# EAGLE schematic ASuitable Number Of Microphones (EAGLE 7.7.0)
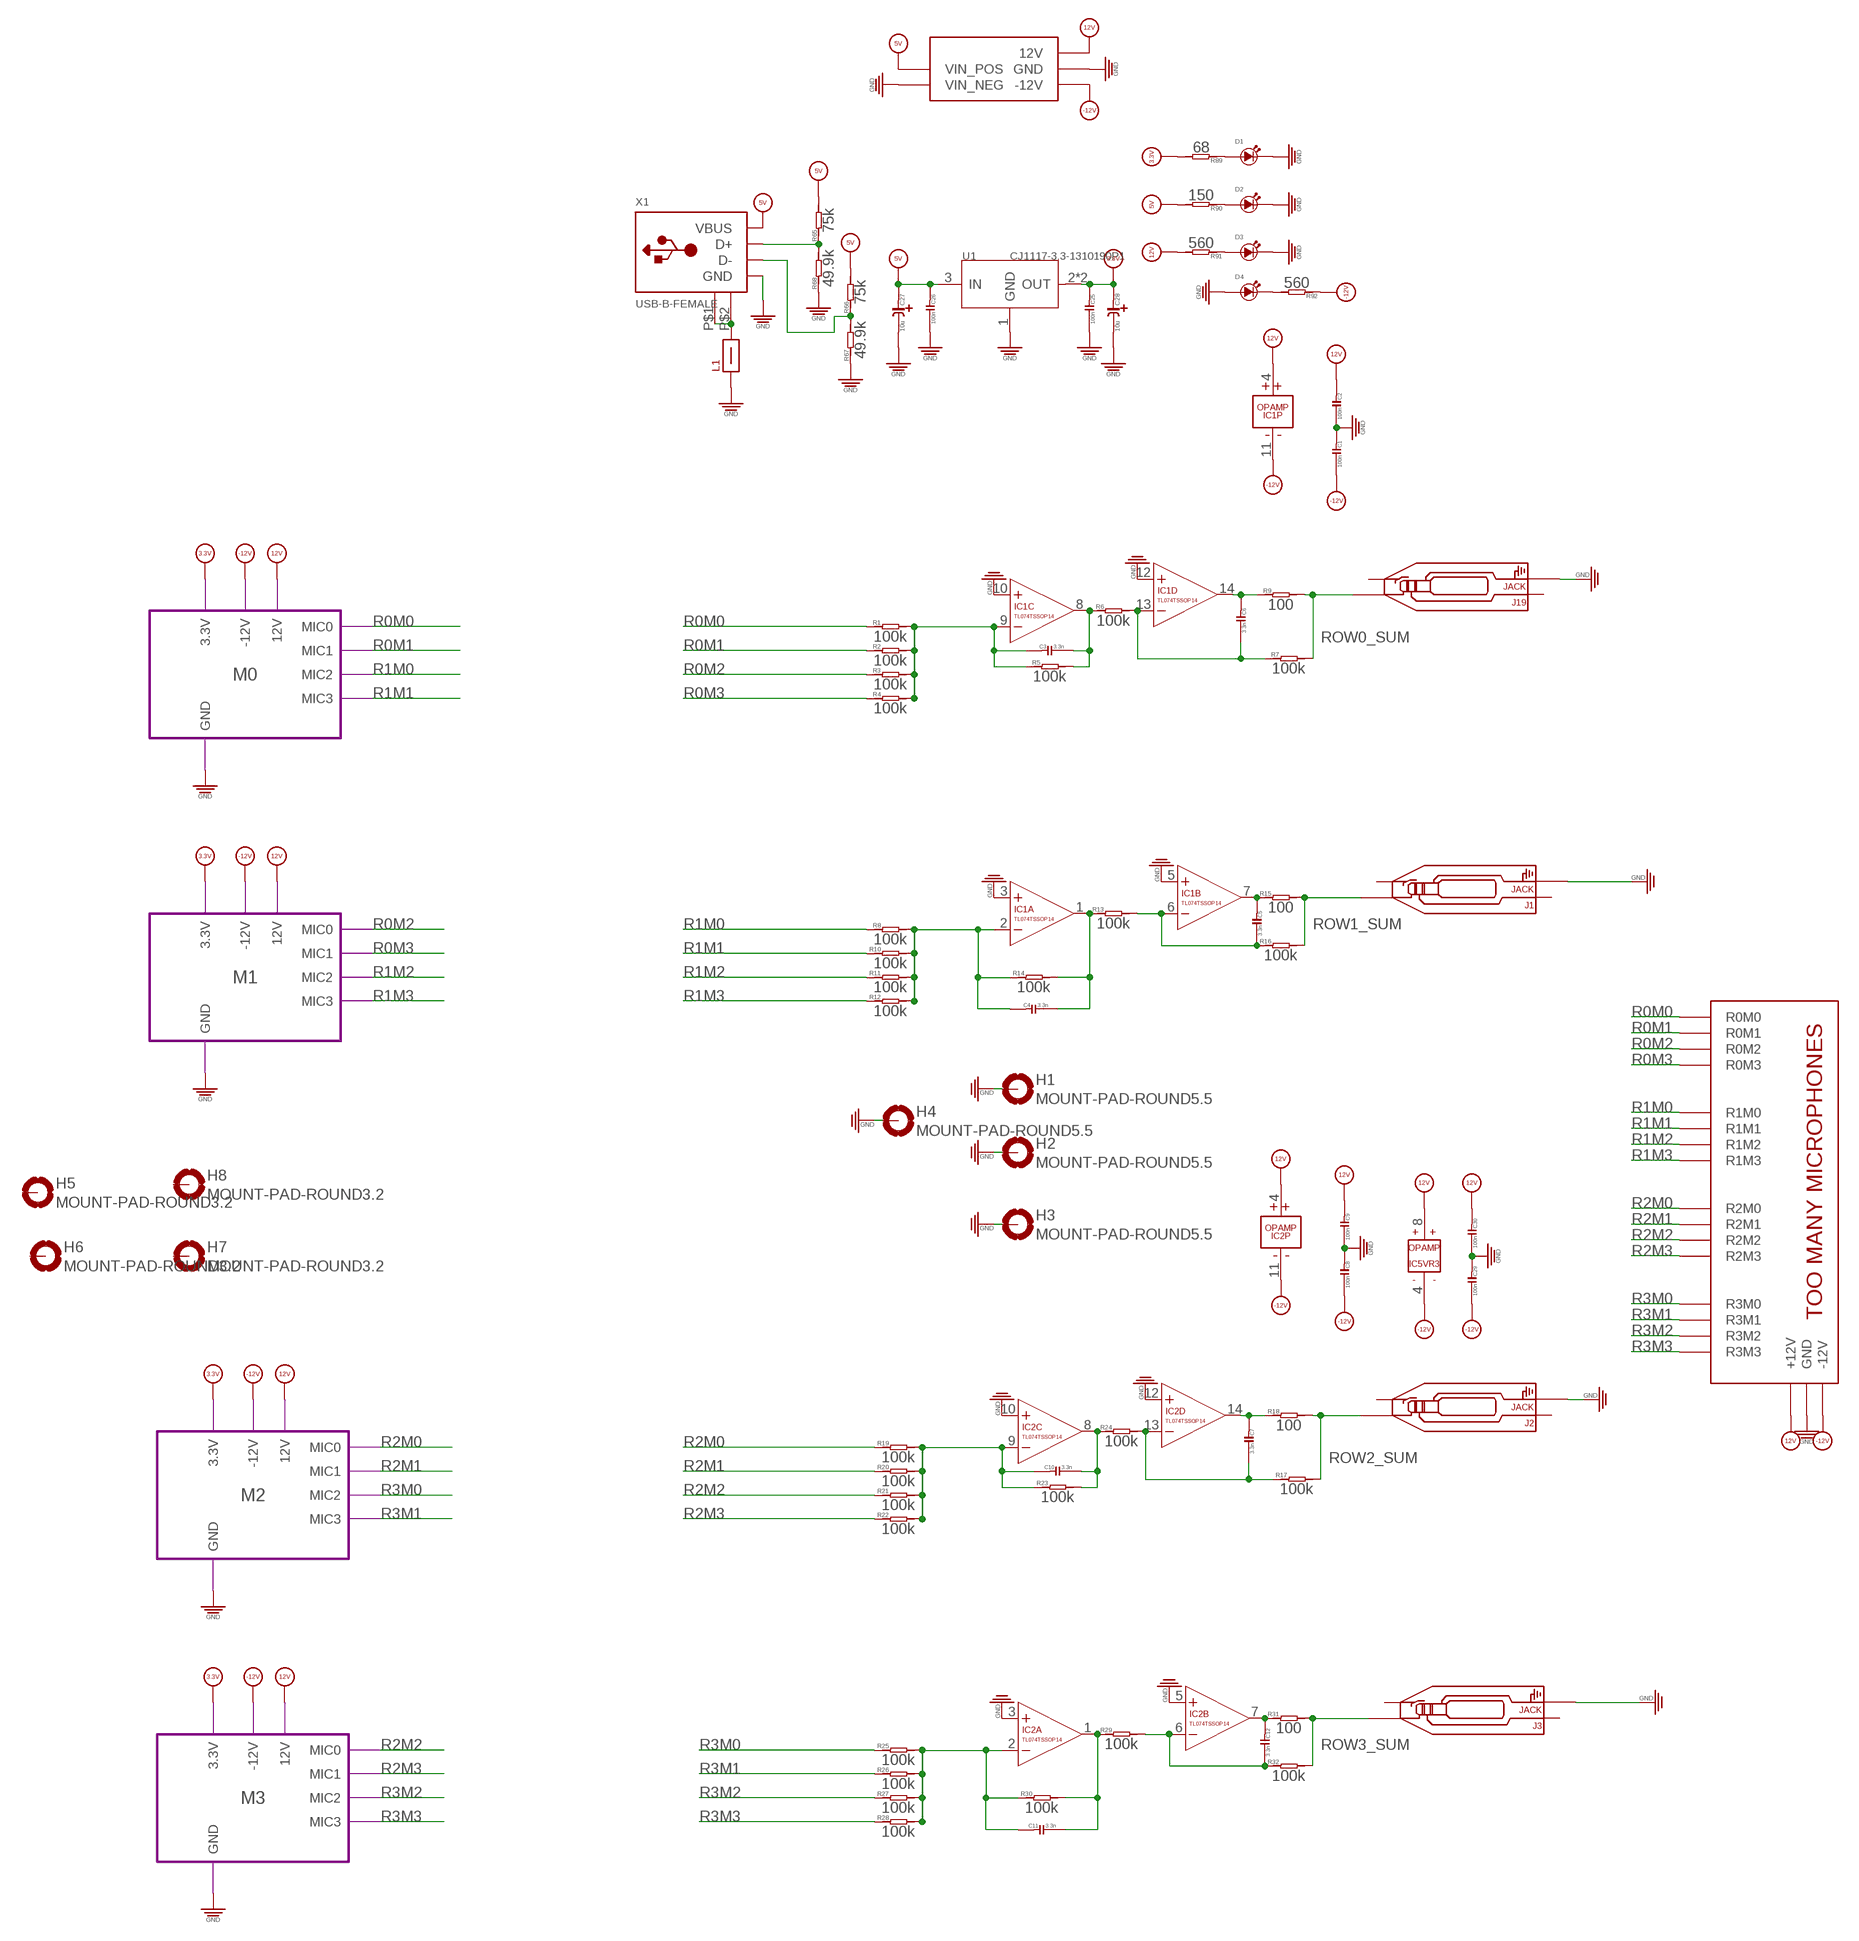
[diagram p0: schematic, sheet 1, part 1 of 2]
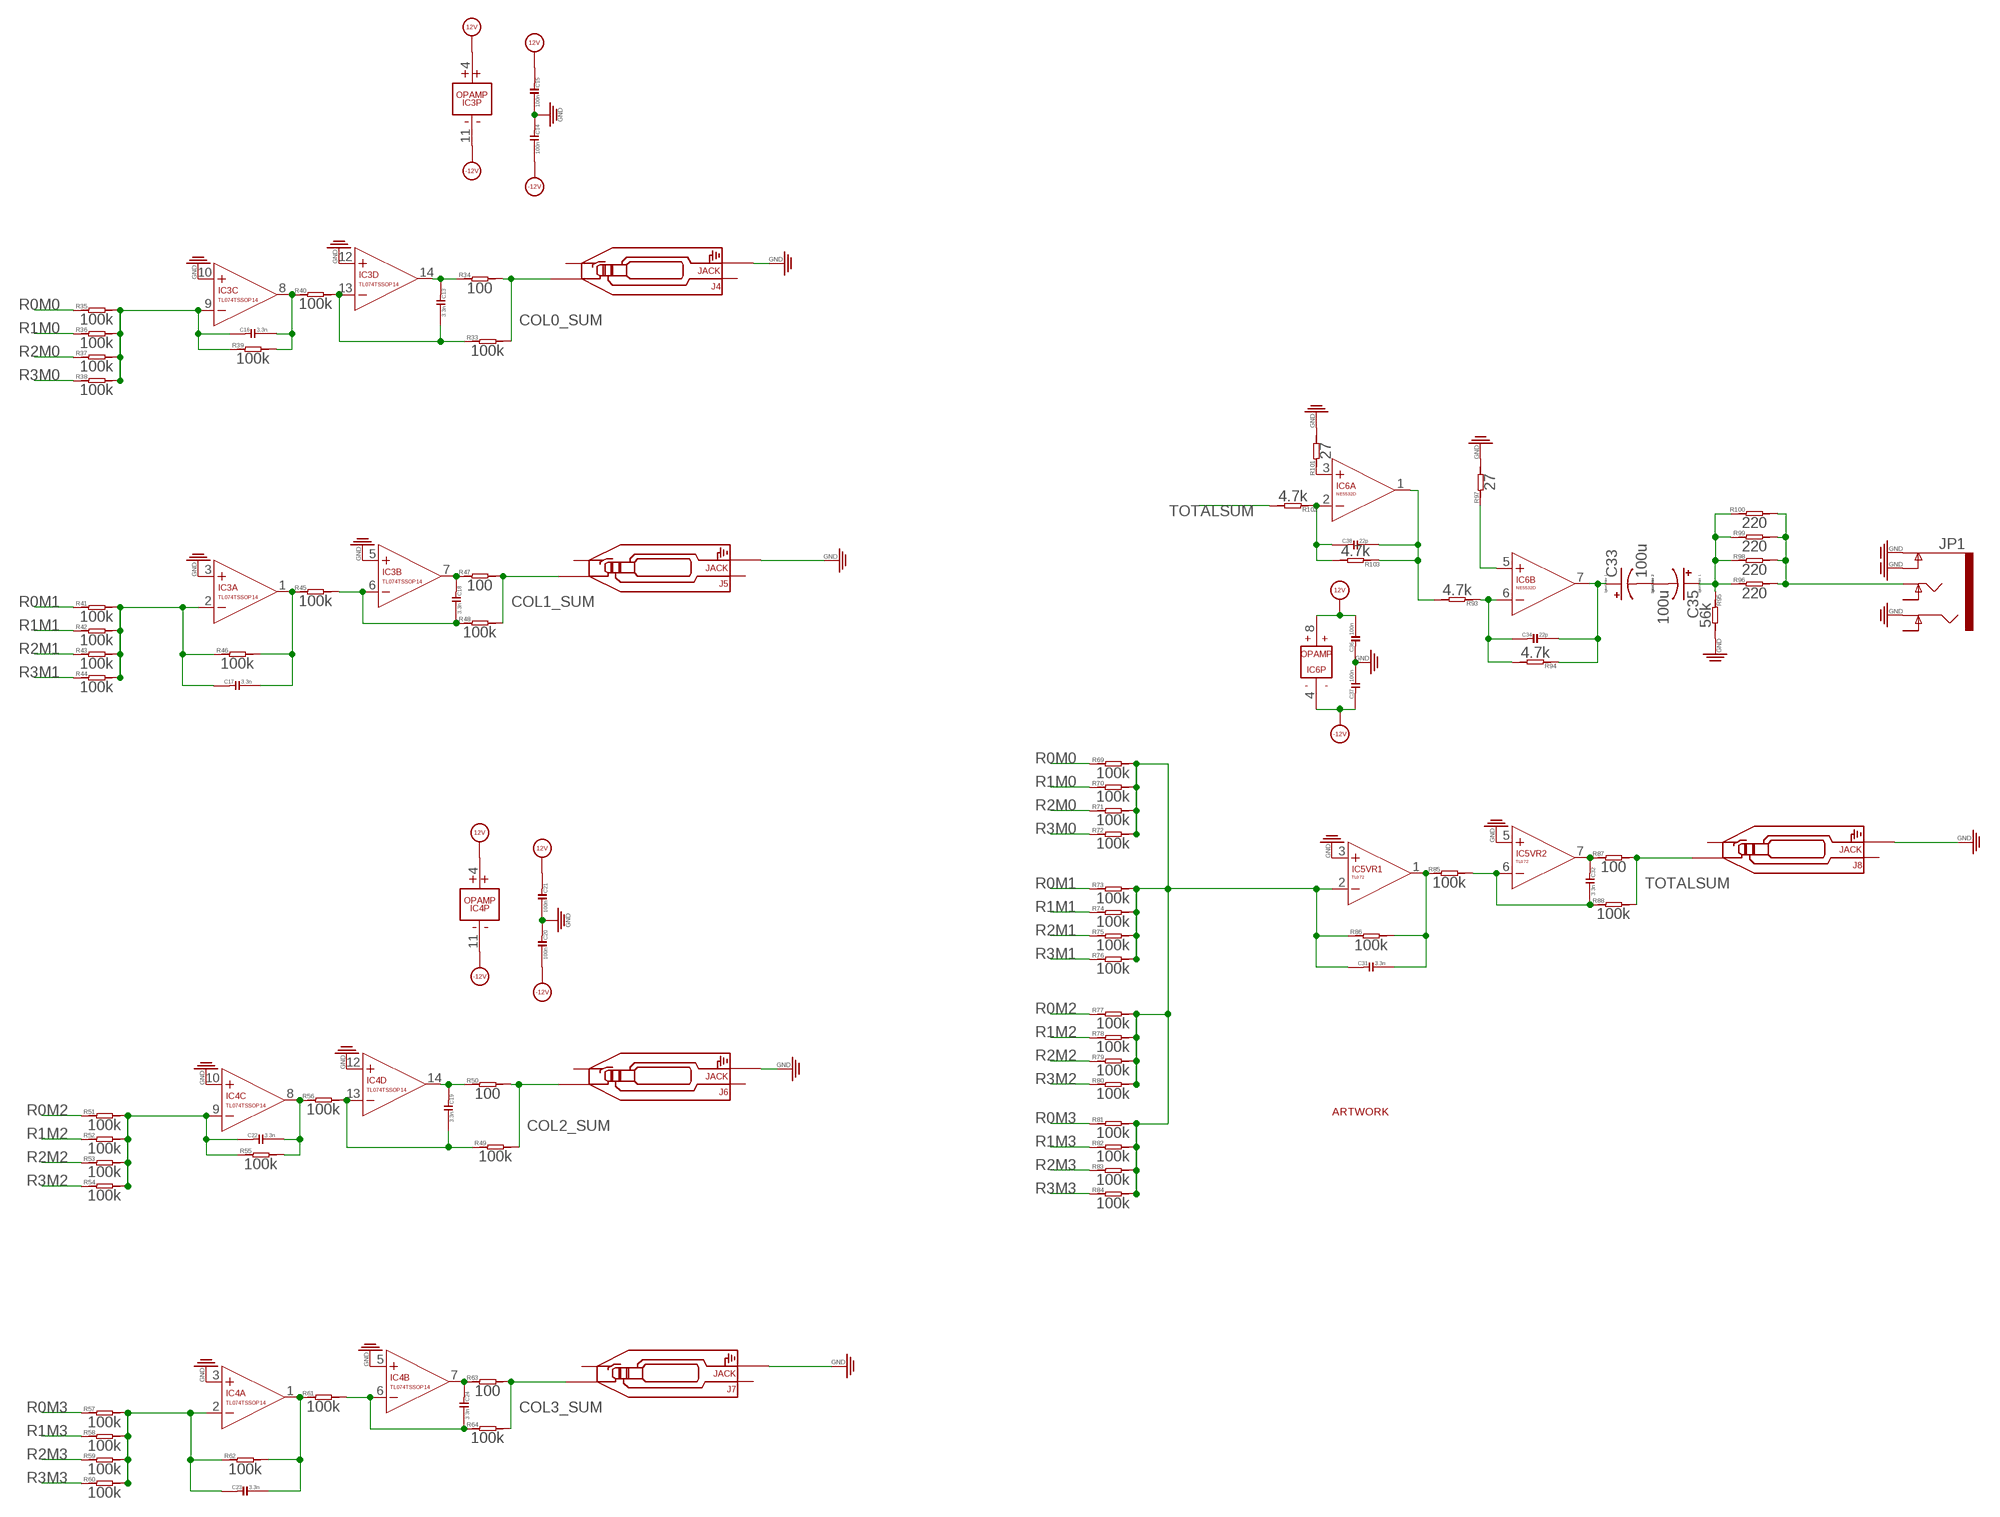
[diagram p1: schematic, sheet 1, part 2 of 2]

## Parts
C1  100n  C-0603  [C0603]
C2  100n  C-0603  [C0603]
C3  3.3n  C-0603  [C0603]
C4  3.3n  C-0603  [C0603]
C5  3.3n  C-0603  [C0603]
C6  3.3n  C-0603  [C0603]
C7  3.3n  C-0603  [C0603]
C8  100n  C-0603  [C0603]
C9  100n  C-0603  [C0603]
C10  3.3n  C-0603  [C0603]
C11  3.3n  C-0603  [C0603]
C12  3.3n  C-0603  [C0603]
C13  3.3n  C-0603  [C0603]
C14  100n  C-0603  [C0603]
C15  100n  C-0603  [C0603]
C16  3.3n  C-0603  [C0603]
C17  3.3n  C-0603  [C0603]
C18  3.3n  C-0603  [C0603]
C19  3.3n  C-0603  [C0603]
C20  100n  C-0603  [C0603]
C21  100n  C-0603  [C0603]
C22  3.3n  C-0603  [C0603]
C23  3.3n  C-0603  [C0603]
C24  3.3n  C-0603  [C0603]
C25  100n  C-0603  [C0603]
C26  100n  C-0603  [C0603]
C27  10u  C-POLAR-A  [CASE-A_3216]
C28  10u  C-POLAR-A  [CASE-A_3216]
C29  100n  C-0603  [C0603]
C30  100n  C-0603  [C0603]
C31  3.3n  C-0603  [C0603]
C32  3.3n  C-0603  [C0603]
C33  100u  CPOL-USD  [PANASONIC_D]
C34  22p  C-0603  [C0603]
C35  100u  CPOL-USD  [PANASONIC_D]
C36  100n  C-0603  [C0603]
C37  100n  C-0603  [C0603]
C38  22p  C-0603  [C0603]
D1  LED  [LED0603]
D2  LED  [LED0603]
D3  LED  [LED0603]
D4  LED  [LED0603]
H1  MOUNT-PAD-ROUND5.5  [5,5-PAD]
H2  MOUNT-PAD-ROUND5.5  [5,5-PAD]
H3  MOUNT-PAD-ROUND5.5  [5,5-PAD]
H4  MOUNT-PAD-ROUND5.5  [5,5-PAD]
H5  MOUNT-PAD-ROUND3.2  [3,2-PAD]
H6  MOUNT-PAD-ROUND3.2  [3,2-PAD]
H7  MOUNT-PAD-ROUND3.2  [3,2-PAD]
H8  MOUNT-PAD-ROUND3.2  [3,2-PAD]
IC1  TL074TSSOP14  [TSSOP14]
IC2  TL074TSSOP14  [TSSOP14]
IC3  TL074TSSOP14  [TSSOP14]
IC4  TL074TSSOP14  [TSSOP14]
IC5  TL072  [SO08]
IC6  NE5532D  [SO08]
J1  JACK  AUDIO-JACK_SMALLSYMBOLNODRILL  [3.5MM-JACK-SWITCH-13MM-NOHOLES]
J2  JACK  AUDIO-JACK_SMALLSYMBOLNODRILL  [3.5MM-JACK-SWITCH-13MM-NOHOLES]
J3  JACK  AUDIO-JACK_SMALLSYMBOLNODRILL  [3.5MM-JACK-SWITCH-13MM-NOHOLES]
J4  JACK  AUDIO-JACK_SMALLSYMBOLNODRILL  [3.5MM-JACK-SWITCH-13MM-NOHOLES]
J5  JACK  AUDIO-JACK_SMALLSYMBOLNODRILL  [3.5MM-JACK-SWITCH-13MM-NOHOLES]
J6  JACK  AUDIO-JACK_SMALLSYMBOLNODRILL  [3.5MM-JACK-SWITCH-13MM-NOHOLES]
J7  JACK  AUDIO-JACK_SMALLSYMBOLNODRILL  [3.5MM-JACK-SWITCH-13MM-NOHOLES]
J8  JACK  AUDIO-JACK_SMALLSYMBOLNODRILL  [3.5MM-JACK-SWITCH-13MM-NOHOLES]
J19  JACK  AUDIO-JACK_SMALLSYMBOLNODRILL  [3.5MM-JACK-SWITCH-13MM-NOHOLES]
JP1  AUDIO-JACK4-.25-HORIZ-TRS  [AUDIO-JACK-.25-INCH-HORIZ-PTH]
L1  FERRITE_1812  [FERRITE_1812]
R1  100k  R-0603  [R0603]
R2  100k  R-0603  [R0603]
R3  100k  R-0603  [R0603]
R4  100k  R-0603  [R0603]
R5  100k  R-0603  [R0603]
R6  100k  R-0603  [R0603]
R7  100k  R-0603  [R0603]
R8  100k  R-0603  [R0603]
R9  100  R-0603  [R0603]
R10  100k  R-0603  [R0603]
R11  100k  R-0603  [R0603]
R12  100k  R-0603  [R0603]
R13  100k  R-0603  [R0603]
R14  100k  R-0603  [R0603]
R15  100  R-0603  [R0603]
R16  100k  R-0603  [R0603]
R17  100k  R-0603  [R0603]
R18  100  R-0603  [R0603]
R19  100k  R-0603  [R0603]
R20  100k  R-0603  [R0603]
R21  100k  R-0603  [R0603]
R22  100k  R-0603  [R0603]
R23  100k  R-0603  [R0603]
R24  100k  R-0603  [R0603]
R25  100k  R-0603  [R0603]
R26  100k  R-0603  [R0603]
R27  100k  R-0603  [R0603]
R28  100k  R-0603  [R0603]
R29  100k  R-0603  [R0603]
R30  100k  R-0603  [R0603]
R31  100  R-0603  [R0603]
R32  100k  R-0603  [R0603]
R33  100k  R-0603  [R0603]
R34  100  R-0603  [R0603]
R35  100k  R-0603  [R0603]
R36  100k  R-0603  [R0603]
R37  100k  R-0603  [R0603]
R38  100k  R-0603  [R0603]
R39  100k  R-0603  [R0603]
R40  100k  R-0603  [R0603]
R41  100k  R-0603  [R0603]
R42  100k  R-0603  [R0603]
R43  100k  R-0603  [R0603]
R44  100k  R-0603  [R0603]
R45  100k  R-0603  [R0603]
R46  100k  R-0603  [R0603]
R47  100  R-0603  [R0603]
R48  100k  R-0603  [R0603]
R49  100k  R-0603  [R0603]
R50  100  R-0603  [R0603]
R51  100k  R-0603  [R0603]
R52  100k  R-0603  [R0603]
R53  100k  R-0603  [R0603]
R54  100k  R-0603  [R0603]
R55  100k  R-0603  [R0603]
R56  100k  R-0603  [R0603]
R57  100k  R-0603  [R0603]
R58  100k  R-0603  [R0603]
R59  100k  R-0603  [R0603]
R60  100k  R-0603  [R0603]
R61  100k  R-0603  [R0603]
R62  100k  R-0603  [R0603]
R63  100  R-0603  [R0603]
R64  100k  R-0603  [R0603]
R65  75k  R-0603  [R0603]
R66  75k  R-0603  [R0603]
R67  49.9k  R-0603  [R0603]
R68  49.9k  R-0603  [R0603]
R69  100k  R-0603  [R0603]
R70  100k  R-0603  [R0603]
R71  100k  R-0603  [R0603]
R72  100k  R-0603  [R0603]
R73  100k  R-0603  [R0603]
R74  100k  R-0603  [R0603]
R75  100k  R-0603  [R0603]
R76  100k  R-0603  [R0603]
R77  100k  R-0603  [R0603]
R78  100k  R-0603  [R0603]
R79  100k  R-0603  [R0603]
R80  100k  R-0603  [R0603]
R81  100k  R-0603  [R0603]
R82  100k  R-0603  [R0603]
R83  100k  R-0603  [R0603]
R84  100k  R-0603  [R0603]
R85  100k  R-0603  [R0603]
R86  100k  R-0603  [R0603]
R87  100  R-0603  [R0603]
R88  100k  R-0603  [R0603]
R89  68  R-0603  [R0603]
R90  150  R-0603  [R0603]
R91  560  R-0603  [R0603]
R92  560  R-0603  [R0603]
R93  4.7k  R-0603  [R0603]
R94  4.7k  R-0603  [R0603]
R95  56k  R-0603  [R0603]
R96  220  R-0603  [R0603]
R97  27  R-0603  [R0603]
R98  220  R-0603  [R0603]
R99  220  R-0603  [R0603]
R100  220  R-0603  [R0603]
R101  27  R-0603  [R0603]
R102  4.7k  R-0603  [R0603]
R103  4.7k  R-0603  [R0603]
U1  CJ1117-3.3-1310190P1  [SOT223]
U$29  TOOMANYMICROPHONES  [TOOMANYMICROPHONES]
U$42  CINCONBRICK_12V  [CINCONBRICK]
U$51  TINRS_ARTWORKTINYDATE  [JUSTATINYROCKET_DATECODE]
X1  USB-B-FEMALE  [FCI61729]

## Module instances
M0 = 4XMIC
M1 = 4XMIC
M2 = 4XMIC
M3 = 4XMIC

## Nets
3.3V [pwr]: C25.1 C28.+ R89.2 U1.2(OUT) U1.TER(OUT) ; port M0.3.3V M1.3.3V M2.3.3V M3.3.3V
5V [pwr]: C26.1 C27.+ R65.2 R66.2 R90.2 U1.3(IN) U$42.1(VIN_POS) U$42.24(VIN_POS) X1.1(VBUS)
12V [pwr]: C2.1 C9.1 C15.1 C21.1 C30.1 C36.2 IC1.4(P:V+) IC2.4(P:V+) IC3.4(P:V+) IC4.4(P:V+) IC5.8(VR3:V+) IC6.8(P:V+) R91.2 U$29.+12@1(+12V) U$29.+12@2(+12V) U$42.11(12V) U$42.14(12V) ; port M0.12V M1.12V M2.12V M3.12V
-12V [pwr]: C1.2 C8.2 C14.2 C20.2 C29.2 C37.1 IC1.11(P:V-) IC2.11(P:V-) IC3.11(P:V-) IC4.11(P:V-) IC5.4(VR3:V-) IC6.4(P:V-) R92.1 U$29.-12@1(-12V) U$29.-12@2(-12V) U$42.2(-12V) U$42.23(-12V) ; port M0.-12V M1.-12V M2.-12V M3.-12V
COL0_SUM: J4.TIP_B@1(TIP) J4.TIP_T@3(TIP) R33.2 R34.2
COL1_SUM: J5.TIP_B@1(TIP) J5.TIP_T@3(TIP) R47.2 R48.2
COL2_SUM: J6.TIP_B@1(TIP) J6.TIP_T@3(TIP) R49.2 R50.2
COL3_SUM: J7.TIP_B@1(TIP) J7.TIP_T@3(TIP) R63.2 R64.2
GND: C1.1 C2.2 C8.1 C9.2 C14.1 C15.2 C20.1 C21.2 C25.2 C26.2 C27.- C28.- C29.1 C30.2 C36.1 C37.2 D1.- D2.- D3.- D4.+ H1.B5,5(MOUNT) H2.B5,5(MOUNT) H3.B5,5(MOUNT) H4.B5,5(MOUNT) IC1.3(A:+IN) IC1.5(B:+IN) IC1.10(C:+IN) IC1.12(D:+IN) IC2.3(A:+IN) IC2.5(B:+IN) IC2.10(C:+IN) IC2.12(D:+IN) IC3.3(A:+IN) IC3.5(B:+IN) IC3.10(C:+IN) IC3.12(D:+IN) IC4.3(A:+IN) IC4.5(B:+IN) IC4.10(C:+IN) IC4.12(D:+IN) IC5.3(VR1:+IN) IC5.5(VR2:+IN) J1.RING_B@1(RING) J1.RING_T@3(RING) J2.RING_B@1(RING) J2.RING_T@3(RING) J3.RING_B@1(RING) J3.RING_T@3(RING) J4.RING_B@1(RING) J4.RING_T@3(RING) J5.RING_B@1(RING) J5.RING_T@3(RING) J6.RING_B@1(RING) J6.RING_T@3(RING) J7.RING_B@1(RING) J7.RING_T@3(RING) J8.RING_B@1(RING) J8.RING_T@3(RING) J19.RING_B@1(RING) J19.RING_T@3(RING) JP1.P$2(EARTH) JP1.P$3(EARTH-NORM) JP1.P$4(RING) L1.P$1 R67.1 R68.1 R95.2 R97.2 R101.2 U1.1(GND) U$29.GND@1(GND) U$29.GND@2(GND) U$29.GND@3(GND) U$29.GND@4(GND) U$42.3(GND) U$42.10(GND) U$42.12(VIN_NEG) U$42.13(VIN_NEG) U$42.15(GND) U$42.22(GND) X1.4(GND) ; port M0.GND M1.GND M2.GND M3.GND
N$1: C3.1 IC1.9(C:-IN) R1.2 R2.2 R3.2 R4.2 R5.1
N$2: C6.1 IC1.14(D:OUT) R9.1
N$3: C6.2 IC1.13(D:-IN) R6.2 R7.1
N$4: L1.P$2 X1.P$1(GND1) X1.P$2(GND2)
N$5: R66.1 R67.2 X1.2(D-)
N$6: R65.1 R68.2 X1.3(D+)
N$7: C31.1 IC5.2(VR1:-IN) R69.2 R70.2 R71.2 R72.2 R73.2 R74.2 R75.2 R76.2 R77.2 R78.2 R79.2 R80.2 R81.2 R82.2 R83.2 R84.2 R86.1
N$8: C3.2 IC1.8(C:OUT) R5.2 R6.1
N$9: C4.1 IC1.2(A:-IN) R8.2 R10.2 R11.2 R12.2 R14.1
N$10: C33.- C35.-
N$11: D1.+ R89.1
N$12: D2.+ R90.1
N$13: D3.+ R91.1
N$14: C4.2 IC1.1(A:OUT) R13.1 R14.2
N$15: C5.1 IC1.7(B:OUT) R15.1
N$16: C5.2 IC1.6(B:-IN) R13.2 R16.1
N$17: C10.1 IC2.9(C:-IN) R19.2 R20.2 R21.2 R22.2 R23.1
N$18: C7.1 IC2.14(D:OUT) R18.1
N$19: D4.- R92.2
N$20: C31.2 IC5.1(VR1:OUT) R85.1 R86.2
N$21: C32.1 IC5.7(VR2:OUT) R87.1
N$22: C32.2 IC5.6(VR2:-IN) R85.2 R88.1
N$23: C7.2 IC2.13(D:-IN) R17.1 R24.2
N$24: C10.2 IC2.8(C:OUT) R23.2 R24.1
N$25: C11.1 IC2.2(A:-IN) R25.2 R26.2 R27.2 R28.2 R30.1
N$26: C34.1 IC6.6(B:-IN) R93.1 R94.2
N$27: C33.+ C34.2 IC6.7(B:OUT) R94.1
N$28: C35.+ R95.1 R96.1 R98.1 R99.1 R100.1
N$29: IC6.5(B:+IN) R97.1
N$30: C11.2 IC2.1(A:OUT) R29.1 R30.2
N$31: C12.1 IC2.7(B:OUT) R31.1
N$32: C12.2 IC2.6(B:-IN) R29.2 R32.1
N$33: C16.1 IC3.9(C:-IN) R35.2 R36.2 R37.2 R38.2 R39.1
N$34: C13.1 IC3.14(D:OUT) R34.1
N$35: IC6.3(A:+IN) R101.1
N$36: C38.1 IC6.2(A:-IN) R102.1 R103.2
N$37: C38.2 IC6.1(A:OUT) R93.2 R103.1
N$39: C13.2 IC3.13(D:-IN) R33.1 R40.2
N$40: C16.2 IC3.8(C:OUT) R39.2 R40.1
N$41: C17.1 IC3.2(A:-IN) R41.2 R42.2 R43.2 R44.2 R46.1
N$46: C17.2 IC3.1(A:OUT) R45.1 R46.2
N$47: C18.1 IC3.7(B:OUT) R47.1
N$48: C18.2 IC3.6(B:-IN) R45.2 R48.1
N$49: C22.1 IC4.9(C:-IN) R51.2 R52.2 R53.2 R54.2 R55.1
N$50: C19.1 IC4.14(D:OUT) R50.1
N$55: C19.2 IC4.13(D:-IN) R49.1 R56.2
N$56: C22.2 IC4.8(C:OUT) R55.2 R56.1
N$57: C23.1 IC4.2(A:-IN) R57.2 R58.2 R59.2 R60.2 R62.1
N$62: C23.2 IC4.1(A:OUT) R61.1 R62.2
N$63: C24.1 IC4.7(B:OUT) R63.1
N$64: C24.2 IC4.6(B:-IN) R61.2 R64.1
OUTTIPLEFT: JP1.P$6(TIP) R96.2 R98.2 R99.2 R100.2
R0M0: R1.1 R35.1 R69.1 U$29.P$1(R0M0) ; port M0.MIC0
R0M1: R2.1 R41.1 R73.1 U$29.P$2(R0M1) ; port M0.MIC1
R0M2: R3.1 R51.1 R77.1 U$29.P$3(R0M2) ; port M1.MIC0
R0M3: R4.1 R57.1 R81.1 U$29.P$4(R0M3) ; port M1.MIC1
R1M0: R8.1 R36.1 R70.1 U$29.P$5(R1M0) ; port M0.MIC2
R1M1: R10.1 R42.1 R74.1 U$29.P$6(R1M1) ; port M0.MIC3
R1M2: R11.1 R52.1 R78.1 U$29.P$7(R1M2) ; port M1.MIC2
R1M3: R12.1 R58.1 R82.1 U$29.P$8(R1M3) ; port M1.MIC3
R2M0: R19.1 R37.1 R71.1 U$29.P$9(R2M0) ; port M2.MIC0
R2M1: R20.1 R43.1 R75.1 U$29.P$10(R2M1) ; port M2.MIC1
R2M2: R21.1 R53.1 R79.1 U$29.P$11(R2M2) ; port M3.MIC0
R2M3: R22.1 R59.1 R83.1 U$29.P$12(R2M3) ; port M3.MIC1
R3M0: R25.1 R38.1 R72.1 U$29.P$13(R3M0) ; port M2.MIC2
R3M1: R26.1 R44.1 R76.1 U$29.P$14(R3M1) ; port M2.MIC3
R3M2: R27.1 R54.1 R80.1 U$29.P$15(R3M2) ; port M3.MIC2
R3M3: R28.1 R60.1 R84.1 U$29.P$16(R3M3) ; port M3.MIC3
ROW0_SUM: J19.TIP_B@1(TIP) J19.TIP_T@3(TIP) R7.2 R9.2
ROW1_SUM: J1.TIP_B@1(TIP) J1.TIP_T@3(TIP) R15.2 R16.2
ROW2_SUM: J2.TIP_B@1(TIP) J2.TIP_T@3(TIP) R17.2 R18.2
ROW3_SUM: J3.TIP_B@1(TIP) J3.TIP_T@3(TIP) R31.2 R32.2
TOTALSUM: J8.TIP_B@1(TIP) J8.TIP_T@3(TIP) R87.2 R88.2 R102.2
Unconnected: H5.B3,2(MOUNT) H6.B3,2(MOUNT) H7.B3,2(MOUNT) H8.B3,2(MOUNT) J1.SECOND_B@1(SECOND) J1.SECOND_T@3(SECOND) J1.SWITCH_B@1(SWITCH) J1.SWITCH_T@3(SWITCH) J2.SECOND_B@1(SECOND) J2.SECOND_T@3(SECOND) J2.SWITCH_B@1(SWITCH) J2.SWITCH_T@3(SWITCH) J3.SECOND_B@1(SECOND) J3.SECOND_T@3(SECOND) J3.SWITCH_B@1(SWITCH) J3.SWITCH_T@3(SWITCH) J4.SECOND_B@1(SECOND) J4.SECOND_T@3(SECOND) J4.SWITCH_B@1(SWITCH) J4.SWITCH_T@3(SWITCH) J5.SECOND_B@1(SECOND) J5.SECOND_T@3(SECOND) J5.SWITCH_B@1(SWITCH) J5.SWITCH_T@3(SWITCH) J6.SECOND_B@1(SECOND) J6.SECOND_T@3(SECOND) J6.SWITCH_B@1(SWITCH) J6.SWITCH_T@3(SWITCH) J7.SECOND_B@1(SECOND) J7.SECOND_T@3(SECOND) J7.SWITCH_B@1(SWITCH) J7.SWITCH_T@3(SWITCH) J8.SECOND_B@1(SECOND) J8.SECOND_T@3(SECOND) J8.SWITCH_B@1(SWITCH) J8.SWITCH_T@3(SWITCH) J19.SECOND_B@1(SECOND) J19.SECOND_T@3(SECOND) J19.SWITCH_B@1(SWITCH) J19.SWITCH_T@3(SWITCH) JP1.P$5(RING-NORM) JP1.P$7(TIP-NORM)

## Library data of the parts
C1-C26 C29-C32 C34 C36-C38 = OPL:C*
C27 C28 = EurorackModularParts:C-POLAR*
C33 C35 = resistor:CPOL-US: POLARIZED CAPACITOR, American symbol
D1-D4 = EurorackModularParts:LED*: LED
H1-H8 = holes:MOUNT-PAD-ROUND: MOUNTING PAD, round
IC1-IC4 = EurorackModularParts:TL074: OP AMP
IC5 = EurorackModularParts:TL072
IC6 = EurorackModularParts:NE5532: AUDIO AMPLIFIER
J1 = EurorackModularParts:AUDIO-JACK_SMALLSYMBOL: Switching Mono 3.5mm Audio Jack from Erthenvar.; DESC: Row 1
J2 = EurorackModularParts:AUDIO-JACK_SMALLSYMBOL: Switching Mono 3.5mm Audio Jack from Erthenvar.; DESC: Row 2
J3 = EurorackModularParts:AUDIO-JACK_SMALLSYMBOL: Switching Mono 3.5mm Audio Jack from Erthenvar.; DESC: Row 3
J4 = EurorackModularParts:AUDIO-JACK_SMALLSYMBOL: Switching Mono 3.5mm Audio Jack from Erthenvar.; DESC: Col 0
J5 = EurorackModularParts:AUDIO-JACK_SMALLSYMBOL: Switching Mono 3.5mm Audio Jack from Erthenvar.; DESC: Col 1
J6 = EurorackModularParts:AUDIO-JACK_SMALLSYMBOL: Switching Mono 3.5mm Audio Jack from Erthenvar.; DESC: Col 2
J7 = EurorackModularParts:AUDIO-JACK_SMALLSYMBOL: Switching Mono 3.5mm Audio Jack from Erthenvar.; DESC: Col 3
J8 = EurorackModularParts:AUDIO-JACK_SMALLSYMBOL: Switching Mono 3.5mm Audio Jack from Erthenvar.; DESC: Sum
J19 = EurorackModularParts:AUDIO-JACK_SMALLSYMBOL: Switching Mono 3.5mm Audio Jack from Erthenvar.; DESC: Row 0
JP1 = EurorackModularParts:AUDIO-JACK4-.25-HORIZ-TRS: 1/4" TRS jack, horizontal Production SKU: COM-11144 Footprint unproven - datasheet and part seem to be slightly different; PROD_ID: COM-11144
L1 = EurorackModularParts:FERRITE
R1-R103 = OPL:R*
U1 = OPL:CJ1117-3.3: 1A Low Dropout Linear Regulator
U$29 = FenixBase:TOOMANYMICROPHONES
U$42 = FenixBase:CINCONBRICK_12V
U$51 = EurorackModularParts:TINRS_ARTWORK
X1 = ld-components:USB-B-FEMALE: USB type B receptacle FCI 61729-59796

## Module 4XMIC
Ports: 3.3V(pwr) GND(pwr) -12V(pwr) 12V(pwr) MIC0(out) MIC1(out) MIC2(out) MIC3(out)
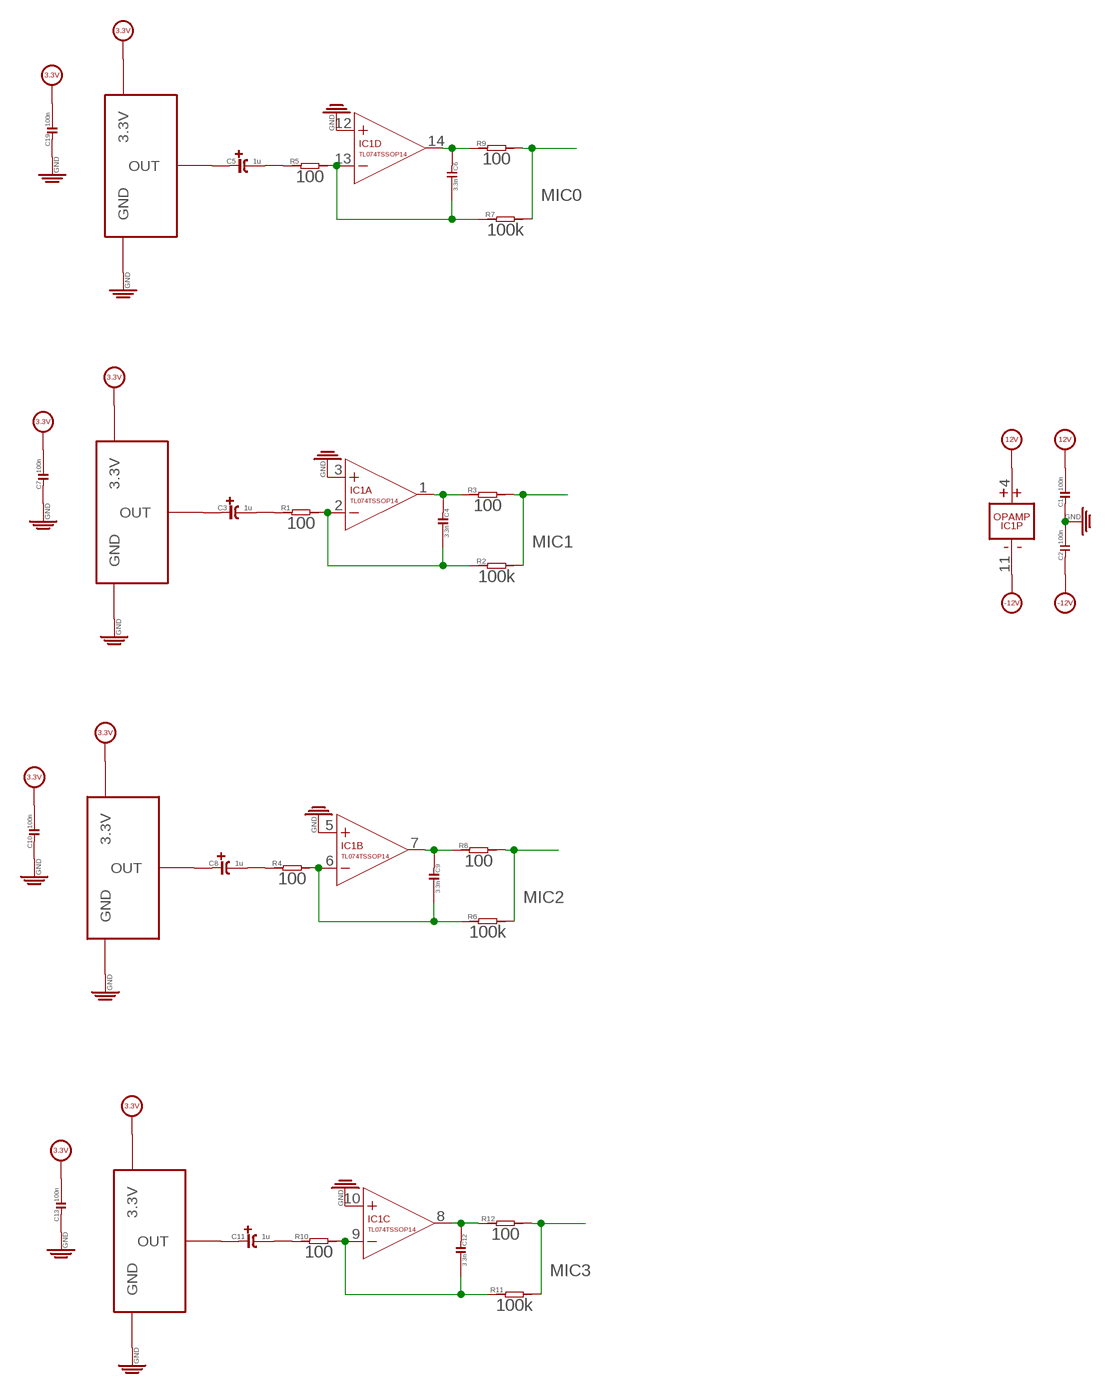
[diagram p2: schematic, module 4XMIC, sheet 1]

### Parts
C1  100n  C-0603  [C0603]
C2  100n  C-0603  [C0603]
C3  1u  C-POLAR-A  [CASE-A_3216]
C4  3.3n  C-0603  [C0603]
C5  1u  C-POLAR-A  [CASE-A_3216]
C6  3.3n  C-0603  [C0603]
C7  100n  C-0603  [C0603]
C8  1u  C-POLAR-A  [CASE-A_3216]
C9  3.3n  C-0603  [C0603]
C10  100n  C-0603  [C0603]
C11  1u  C-POLAR-A  [CASE-A_3216]
C12  3.3n  C-0603  [C0603]
C13  100n  C-0603  [C0603]
C19  100n  C-0603  [C0603]
IC1  TL074TSSOP14  [TSSOP14]
MIC0  SPU0410HR5H-PB  [SPU0410HR5H-PB]
MIC1  SPU0410HR5H-PB  [SPU0410HR5H-PB]
MIC2  SPU0410HR5H-PB  [SPU0410HR5H-PB]
MIC3  SPU0410HR5H-PB  [SPU0410HR5H-PB]
R1  100  R-0603  [R0603]
R2  100k  R-0603  [R0603]
R3  100  R-0603  [R0603]
R4  100  R-0603  [R0603]
R5  100  R-0603  [R0603]
R6  100k  R-0603  [R0603]
R7  100k  R-0603  [R0603]
R8  100  R-0603  [R0603]
R9  100  R-0603  [R0603]
R10  100  R-0603  [R0603]
R11  100k  R-0603  [R0603]
R12  100  R-0603  [R0603]

### Nets
3.3V: C7.2 C10.2 C13.2 C19.2 MIC0.P$1(3.3V) MIC1.P$1(3.3V) MIC2.P$1(3.3V) MIC3.P$1(3.3V)
12V: C1.2 IC1.4(P:V+)
-12V: C2.1 IC1.11(P:V-)
GND: C1.1 C2.2 C7.1 C10.1 C13.1 C19.1 IC1.3(A:+IN) IC1.5(B:+IN) IC1.10(C:+IN) IC1.12(D:+IN) MIC0.P$2(GND) MIC0.P$3(GND) MIC1.P$2(GND) MIC1.P$3(GND) MIC2.P$2(GND) MIC2.P$3(GND) MIC3.P$2(GND) MIC3.P$3(GND)
MIC0: R7.2 R9.2
MIC1: R2.2 R3.2
MIC2: R6.2 R8.2
MIC3: R11.2 R12.2
N$1: C6.2 IC1.13(D:-IN) R5.2 R7.1
N$2: C6.1 IC1.14(D:OUT) R9.1
N$3: C4.2 IC1.2(A:-IN) R1.2 R2.1
N$4: C4.1 IC1.1(A:OUT) R3.1
N$5: C9.2 IC1.6(B:-IN) R4.2 R6.1
N$7: C12.2 IC1.9(C:-IN) R10.2 R11.1
N$9: C9.1 IC1.7(B:OUT) R8.1
N$10: C12.1 IC1.8(C:OUT) R12.1
N$14: C11.- R10.1
N$15: C11.+ MIC3.P$4(OUT)
N$16: C8.+ MIC2.P$4(OUT)
N$17: C5.- R5.1
N$18: C5.+ MIC0.P$4(OUT)
N$19: C8.- R4.1
N$20: C3.+ MIC1.P$4(OUT)
N$21: C3.- R1.1

### Library data of the parts
C1 C2 C4 C6 C7 C9 C10 C12 C13 C19 = OPL:C*
C3 C5 C8 C11 = EurorackModularParts:C-POLAR*
IC1 = EurorackModularParts:TL074: OP AMP
MIC0 MIC1-MIC3 = FenixBase:SPU0410HR5H-PB
R1-R12 = OPL:R*

## Net classes
0 default: width 0.254 mm
1 pwr: width 0.508 mm